# Altium project Green house hardware project.PrjPCB
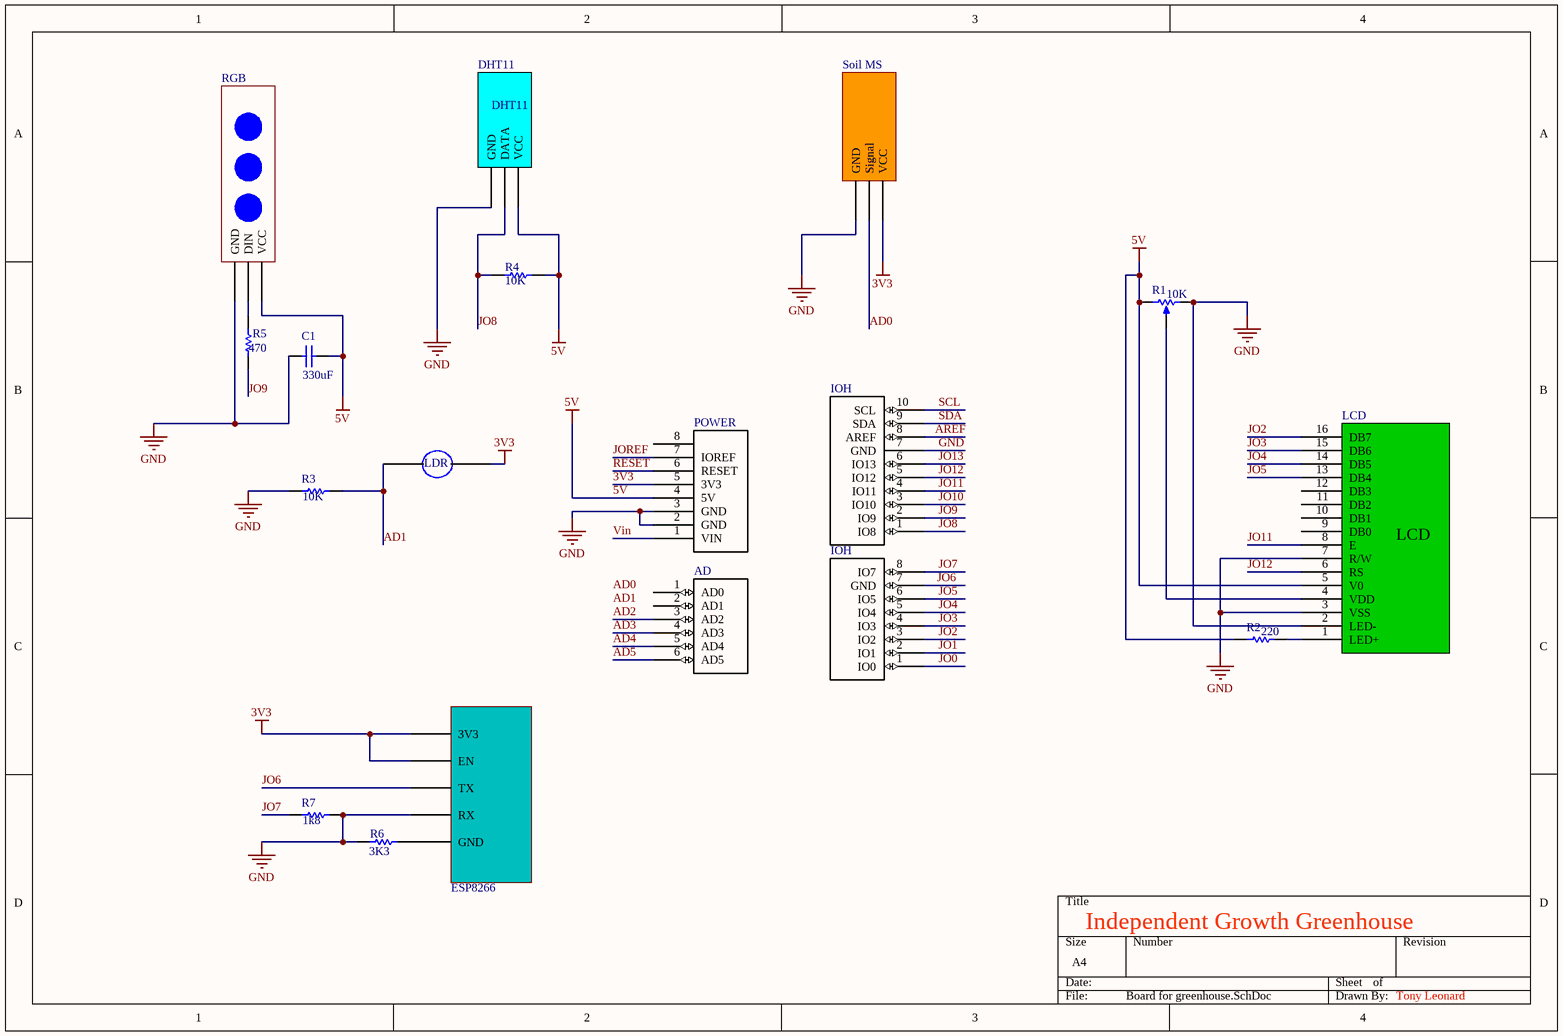
[diagram p0: Board for greenhouse.SchDoc]
1 sheet, 18 parts. Net scope: global (net labels, ports and power ports of the same name join across sheets).
Board file: PCB Greenhouse.PcbDoc

## Sheet Board for greenhouse.SchDoc
size A4

### Parts
AD  Component_4  [AD_Component]  (value not drawn)
C1  value 330uF  [RAD-0.3]  (hidden comment: Cap)
DHT11  DHT11  [DHT11]  (value not drawn)
ESP8266  Component_1  [ESP8266]  (value not drawn)
IOH1  Component_2  [IOH2_Component]  (value not drawn)
IOH2  Component_3  [IOH_Component]  (value not drawn)
LCD  LCD  [LCD]  (value not drawn)
LDR  LDR  [LDR]  (value not drawn)
POWER  Component_1  [Power_component]  (value not drawn)
R1  value 10K  [10K_POT]  (hidden comment: RPot)
R2  value 220  [AXIAL-0.3]  (hidden comment: Res1)
R3  value 10K  [AXIAL-0.3]  (hidden comment: Res1)
R4  value 10K  [AXIAL-0.3]  (hidden comment: Res1)
R5  value 470  [AXIAL-0.3]  (hidden comment: Res1)
R6  value 3K3  [AXIAL-0.3]  (hidden comment: Res1)
R7  value 1k8  [AXIAL-0.3]  (hidden comment: Res1)
RGB  RGB  [RGB]  (value not drawn)
Soil_MS  Soil MS  [Soil MS]

### Nets
3V3: ESP8266.1(3V3) ESP8266.2(EN) LDR.2 POWER.5(3V3) Soil_MS.3(VCC)
5V: C1.1 DHT11.3(VCC) LCD.5(V0) POWER.4(5V) R1.1(TOP) R2.1 R4.2 RGB.3(VCC)
GND: C1.2 DHT11.1(GND) ESP8266.4(RX) IOH1.7(GND) LCD.2(LED-) LCD.3(VSS) LCD.7(R/W) POWER.2(GND) POWER.3(GND) R1.2(BOT) R3.1 R6.2 R7.2 RGB.1(GND) Soil_MS.1(GND)
AD0: Soil_MS.2(Signal)
AD1: LDR.1 R3.2
AD2: AD.3(AD2)
AD3: AD.4(AD3)
AD4: AD.5(AD4)
AD5: AD.6(AD5)
AREF: IOH1.8(AREF)
JO0: IOH2.1(IO0)
JO1: IOH2.2(IO1)
JO2: IOH2.3(IO2) LCD.16(DB7)
JO3: IOH2.4(IO3) LCD.15(DB6)
JO4: IOH2.5(IO4) LCD.14(DB5)
JO5: IOH2.6(IO5) LCD.13(DB4)
JO6: ESP8266.3(TX) IOH2.7(GND)
JO7: IOH2.8(IO7) R7.1
JO8: DHT11.2(DATA) IOH1.1(IO8) R4.1
JO9: IOH1.2(IO9) R5.1
JO10: IOH1.3(IO10)
JO11: IOH1.4(IO11) LCD.8(E)
JO12: IOH1.5(IO12) LCD.6(RS)
JO13: IOH1.6(IO13)
JOREF: POWER.7(IOREF)
RESET: POWER.6(RESET)
SCL: IOH1.10(SCL)
SDA: IOH1.9(SDA)
Vin: POWER.1(VIN)
NetESP8266_5: ESP8266.5(GND) R6.1
NetLCD_1: LCD.1(LED+) R2.2
NetLCD_4: LCD.4(VDD) R1.3(TAP)
NetR5_2: R5.2 RGB.2(DIN)

Not connected (* = marked no-connect by the designer): AD 1(AD0) 2(AD1); LCD 9(DB0) 10(DB1) 11(DB2) 12(DB3); POWER 8

### Notes on the sheet
- Independent Growth Greenhouse
- Tony Leonard
- Labels drawn without touching a wire or pin: AD0, AD1
- (in symbol Component_1) IOH; POWER; AD

### Library data of the parts
AD IOH1 IOH2 = Component_1
C1 = Cap: Capacitor; Published: 8-Jun-2000; LatestRevisionDate: 17-Jul-2002; LatestRevisionNote: Re-released for DXP Platform.; PackageReference: RAD-0.3; Publisher: Altium Limited; PackageDescription: Radial Cap, Thru-Hole; 2 Leads; 0.3 in Pin Spacing
R1 = RPot: Potentiometer; Sim Note: Enter the Resistance value and the set point into parameter fields.; Set Position: 0.5; Published: 8-Jun-2000; LatestRevisionDate: 17-Jul-2002; LatestRevisionNote: Re-released for DXP Platform.; PackageReference: VR5; Publisher: Altium Limited; PackageDescription: Variable Resistor, Thru-Hole; 3 Leads
R2-R7 = Res1: Resistor; Published: 8-Jun-2000; LatestRevisionDate: 17-Jul-2002; LatestRevisionNote: Re-released for DXP Platform.; PackageReference: AXIAL-0.3; Publisher: Altium Limited; PackageDescription: Axial Device, Thru-Hole; 2 Leads; 0.3 in Pin Spacing